# EAGLE schematic untitled (EAGLE 7.1.0)
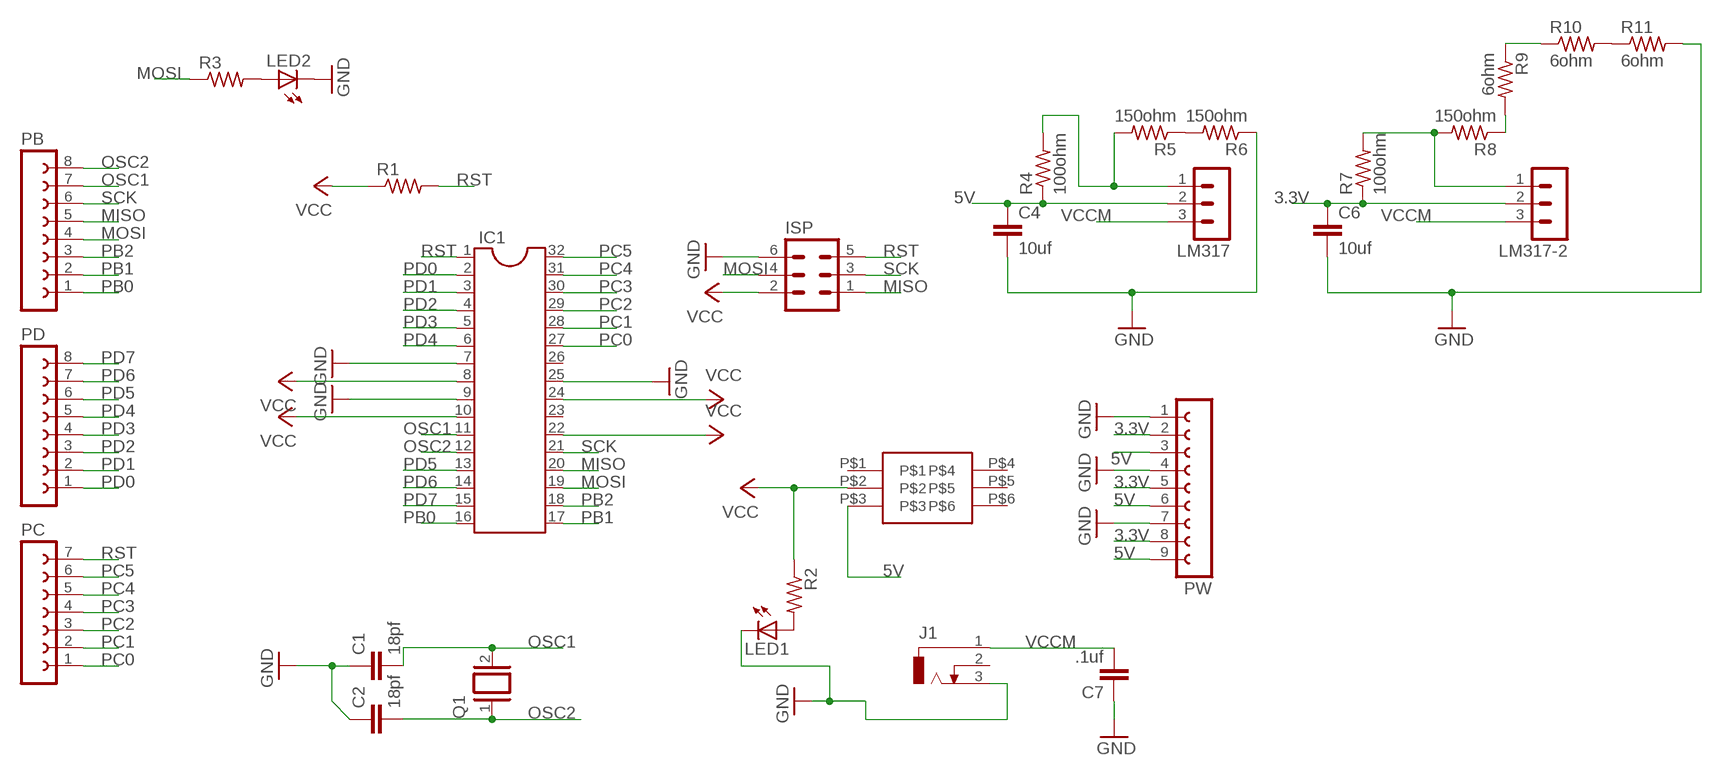
[diagram p0: schematic, sheet 1]

## Parts
C1  18pf  C2.5/2  [C2.5-2]
C2  18pf  C2.5/2  [C2.5-2]
C4  10uf  C15/5  [C15B5]
C6  10uf  C15/5  [C15B5]
C7  .1uf  C5/2.5  [C5B2.5]
IC1  DIL32  [DIL32]
ISP  MA03-2  [MA03-2]
J1  DCJ0303  [DCJ0303]
LED1  LED3MM  [LED3MM]
LED2  LED5MM  [LED5MM]
LM317  MA03-1  [MA03-1]
LM317-2  MA03-1  [MA03-1]
PB  FE08-1  [FE08]
PC  FE07-1  [FE07]
PD  FE08-1  [FE08]
PW  FE09-1  [FE09]
Q1  XTAL/S  [QS]
R1  R-US_0207/10  [0207/10]
R2  R-US_0207/10  [0207/10]
R3  R-US_0207/10  [0207/10]
R4  100ohm  R-US_0207/10  [0207/10]
R5  150ohm  R-US_0207/10  [0207/10]
R6  150ohm  R-US_0207/10  [0207/10]
R7  100ohm  R-US_0207/10  [0207/10]
R8  150ohm  R-US_0207/10  [0207/10]
R9  6ohm  R-US_0207/10  [0207/10]
R10  6ohm  R-US_0207/10  [0207/10]
R11  6ohm  R-US_0207/10  [0207/10]
U$1  6PINPUSHSC2BIGJOE-CUSTOM  [6PINPUSH]

## Nets
3.3V: C6.1 LM317-2.2 PW.2 PW.5 PW.8 R7.1
5V: C4.1 LM317.2 PW.3 PW.6 PW.9 R4.1 U$1.P$3
GND: C1.1 C2.1 C4.2 C6.2 C7.1 IC1.7 IC1.9 IC1.25 ISP.6 J1.3 LED1.K(C) LED2.K(C) PW.1 PW.4 PW.7 R6.1 R11.2
MISO: IC1.20 ISP.1 PB.5
MOSI: IC1.19 ISP.4 PB.4 R3.1
N$1: LM317.1 R4.2 R5.2
N$2: R9.1 R10.1
N$3: LED1.A R2.2
N$4: LED2.A R3.2
N$5: LM317-2.1 R7.2 R8.2
N$7: R5.1 R6.2
N$8: R8.1 R9.2
N$9: R10.2 R11.1
OSC1: C1.2 IC1.11 PB.7 Q1.2
OSC2: C2.2 IC1.12 PB.8 Q1.1
PB0: IC1.16 PB.1
PB1: IC1.17 PB.2
PB2: IC1.18 PB.3
PC0: IC1.27 PC.1
PC1: IC1.28 PC.2
PC2: IC1.29 PC.3
PC3: IC1.30 PC.4
PC4: IC1.31 PC.5
PC5: IC1.32 PC.6
PD0: IC1.2 PD.1
PD1: IC1.3 PD.2
PD2: IC1.4 PD.3
PD3: IC1.5 PD.4
PD4: IC1.6 PD.5
PD5: IC1.13 PD.6
PD6: IC1.14 PD.7
PD7: IC1.15 PD.8
RST: IC1.1 ISP.5 PC.7 R1.2
SCK: IC1.21 ISP.3 PB.6
VCC: IC1.8 IC1.10 IC1.22 IC1.24 ISP.2 R1.1 R2.1 U$1.P$2
VCCM: C7.2 J1.1 LM317-2.3 LM317.3
Unconnected: IC1.23 IC1.26 J1.2 U$1.P$1 U$1.P$4 U$1.P$5 U$1.P$6

## Library data of the parts
C1 C2 C4 C6 = capacitor-wima:C: CAPACITOR naming: grid - package width; OC_NEWARK: unknown
C7 = capacitor-wima:C: CAPACITOR naming: grid - package width
IC1 = ic-package-2:DIL32: Dual In Line; OC_NEWARK: unknown
ISP = con-lstb:MA03-2: PIN HEADER; OC_FARNELL: unknown; OC_NEWARK: unknown
J1 = con-jack-2:DCJ0303: DC POWER JACK Source: DCJ0303.pdf; OC_FARNELL: unknown; OC_NEWARK: unknown
LED1 LED2 = led:LED: LED OSRAM: - CHIPLED LG R971, LG N971, LY N971, LG Q971, LY Q971, LO R971, LY R971 LH N974, LH R974 LS Q976, LO Q976, LY Q976 LO Q996 - Hyper CHIPLED LW Q18S LB Q993, LB Q99A, LB R99A - SideLED LS A670, LO A670, LY A670, LG A670, LP A670 LB A673, LV A673, LT A673, LW A673 LH A674 LY A675 LS A676, LA A676, LO A676, LY A676, LW A676 LS A679, LY A679, LG A679 - Hyper Micro SIDELED® LS Y876, LA Y876, LO Y876, LY Y876 LT Y87S - SmartLED LW L88C, LW L88S LB L89C, LB L89S, LG L890 LS L89K, LO L89K, LY L89K LS L896, LA L896, LO L896, LY L896 - TOPLED LS T670, LO T670, LY T670, LG T670, LP T670 LSG T670, LSP T670, LSY T670, LOP T670, LYG T670 LG T671, LOG T671, LSG T671 LB T673, LV T673, LT T673, LW T673 LH T674 LS T676, LA T676, LO T676, LY T676, LB T676, LH T676, LSB T676, LW T676 LB T67C, LV T67C, LT T67C, LS T67K, LO T67K, LY T67K, LW E67C LS E67B, LA E67B, LO E67B, LY E67B, LB E67C, LV E67C, LT E67C LW T67C LS T679, LY T679, LG T679 LS T770, LO T770, LY T770, LG T770, LP T770 LB T773, LV T773, LT T773, LW T773 LH T774 LS E675, LA E675, LY E675, LS T675 LS T776, LA T776, LO T776, LY T776, LB T776 LHGB T686 LT T68C, LB T68C - Hyper Mini TOPLED® LB M676 - Mini TOPLED Santana® LG M470 LS M47K, LO M47K, LY M47K Source: http://www.osram.convergy.de LUXEON: - LUMILED® LXK2-PW12-R00, LXK2-PW12-S00, LXK2-PW14-U00, LXK2-PW14-V00 LXK2-PM12-R00, LXK2-PM12-S00, LXK2-PM14-U00 LXK2-PE12-Q00, LXK2-PE12-R00, LXK2-PE12-S00, LXK2-PE14-T00, LXK2-PE14-U00 LXK2-PB12-K00, LXK2-PB12-L00, LXK2-PB12-M00, LXK2-PB14-N00, LXK2-PB14-P00, LXK2-PB14-Q00 LXK2-PR12-L00, LXK2-PR12-M00, LXK2-PR14-Q00, LXK2-PR14-R00 LXK2-PD12-Q00, LXK2-PD12-R00, LXK2-PD12-S00 LXK2-PH12-R00, LXK2-PH12-S00 LXK2-PL12-P00, LXK2-PL12-Q00, LXK2-PL12-R00 Source: www.luxeon.com KINGBRIGHT: KA-3528ASYC Source: www.kingbright.com; OC_NEWARK: unknown
LM317 LM317-2 = con-lstb:MA03-1: PIN HEADER; OC_FARNELL: unknown; OC_NEWARK: unknown
PB PD = con-lsta:FE08-1: FEMALE HEADER; OC_FARNELL: unknown; OC_NEWARK: unknown
PC = con-lsta:FE07-1: FEMALE HEADER; OC_FARNELL: unknown; OC_NEWARK: unknown
PW = con-lsta:FE09-1: FEMALE HEADER; OC_FARNELL: unknown; OC_NEWARK: unknown
Q1 = special:XTAL/S: CRYSTAL; OC_NEWARK: unknown
R1-R3 R5 R6 R8-R11 = resistor:R-US_: RESISTOR, American symbol; OC_NEWARK: unknown
R4 R7 = resistor:R-US_: RESISTOR, American symbol; MF: Multicomp Passives; MPN: MC00625W04021220R; OC_NEWARK: 58K4283
U$1 = untitled:6PINPUSH; OC_NEWARK: unknown